# EAGLE schematic IGVC controller v1.6 (EAGLE 6.3)
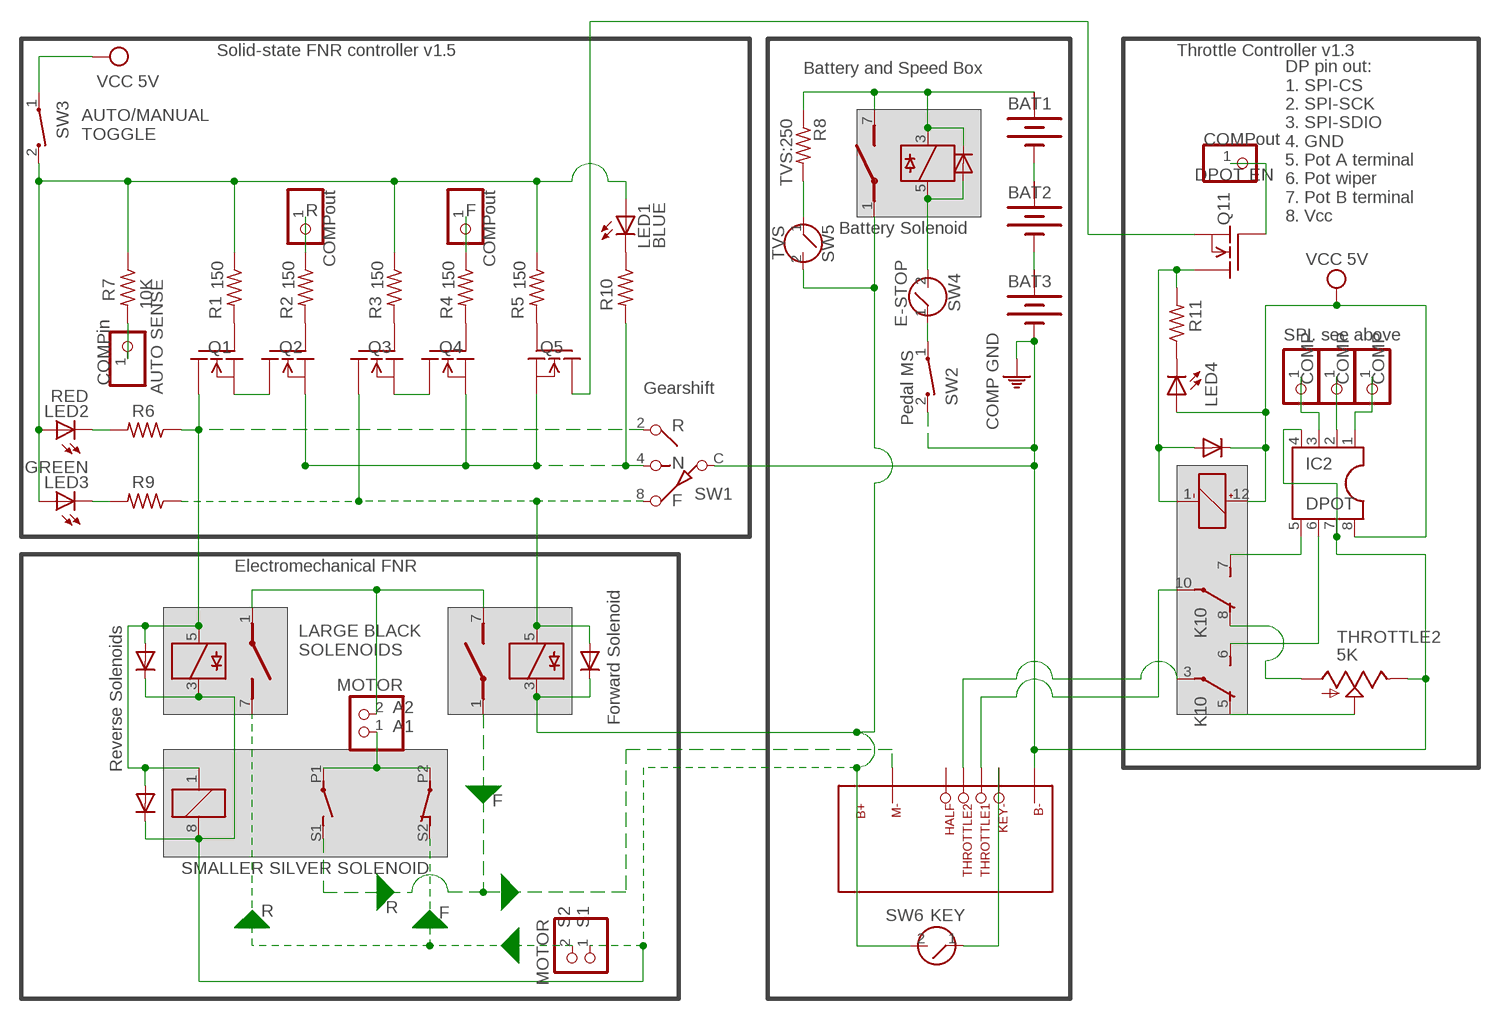
[diagram p0: schematic, sheet 1]

## Parts
BAT1  BATTERY  [BATTERY]
BAT2  BATTERY  [BATTERY]
BAT3  BATTERY  [BATTERY]
D5  1N4004  [DO41-10]
D12  1N4004  [DO41-10]
D13  1N4004  [DO41-10]
D14  1N4004  [DO41-10]
D16  1N4004  [DO41-10]
IC2  DPOT  DIL8  [DIL08]
JP10  COMP  PINHD-1X1  [1X01]
JP11  COMP  PINHD-1X1  [1X01]
JP12  COMP  PINHD-1X1  [1X01]
JP13  COMPout  PINHD-1X1  [1X01]
JP29  MOTOR  PINHD-1X2  [1X02]
JP30  MOTOR  PINHD-1X2  [1X02]
JP31  COMPin  PINHD-1X1  [1X01]
JP32  COMPout  PINHD-1X1  [1X01]
JP33  COMPout  PINHD-1X1  [1X01]
K2  35701331  [REED]
K3  35701331  [REED]
K4  G6C-2117P  [G6C-2117P]
K5  35701331  [REED]
K10  DF2-L-DC24V  [DF2]
LED1  BLUE  LED3MM  [LED3MM]
LED2  RED  LED3MM  [LED3MM]
LED3  GREEN  LED3MM  [LED3MM]
LED4  LED3MM  [LED3MM]
Q1  BUZ11  [TO220]
Q2  BUZ11  [TO220]
Q3  BUZ11  [TO220]
Q4  BUZ11  [TO220]
Q5  BUZ11  [TO220]
Q11  BUZ11  [TO220]
R1  150  R-US_0204/5  [0204/5@1]
R2  150  R-US_0204/5  [0204/5@1]
R3  150  R-US_0204/5  [0204/5@1]
R4  150  R-US_0204/5  [0204/5@1]
R5  150  R-US_0204/5  [0204/5@1]
R6  R-US_0204/5  [0204/5@1]
R7  10K  R-US_0204/5  [0204/5@1]
R8  TVS:250  R-US_0204/5  [0204/5@1]
R9  R-US_0204/5  [0204/5@1]
R10  R-US_0204/5  [0204/5@1]
R11  R-US_0204/5  [0204/5@1]
SW1  SW-1P3T  [SW-C10]
SW2  Pedal MS  CT10-XXXX-A2  [CT10-XXXX-A2]
SW3  Pedal MS  CT10-XXXX-A2  [CT10-XXXX-A2]
SW4  E-STOP  SWITCH  [SWITCH]
SW5  TVS  SWITCH  [SWITCH]
SW6  KEY  SWITCH  [SWITCH]
THROTTLE2  5K  TRIM_US-CT6  [CT6]
U$5  MOTOR-CONTROLLER  [MOTOR-CONTROLLER]

## Nets
+5V [usbvcc]: D5.C IC2.8 K10.12(1:+) LED4.A SW3.1 ; supply symbol labelled VCC 5V
+36V: BAT1.+ D16.C K5.3 K5.7(2:S) R8.1
A1: JP29.1 K4.P1(2:P) K4.P2(3:P)
A2: JP29.2 K2.1(2:P) K3.7(2:S)
B+: D12.C D13.C D14.C JP30.1 K2.3 K3.3 K4.8 K5.1(2:P) SW5.2 SW6.2 U$5.P$2(B+)
FGND1: D14.A K3.5 Q3.2(D) R9.1 SW1.8
GND [gnd]: BAT3.- IC2.4 IC2.7 SW1.C SW2.2 THROTTLE2.E U$5.P$1(B-) ; supply symbol labelled COMP GND
M-1: K3.1(2:P) K4.S1(2:S) U$5.P$3(M-)
N: Q2.3(S) Q4.3(S) Q5.3(S) R10.2 SW1.4
N$1: D16.A K5.5 SW4.2
N$2: LED4.K(C) R11.1
N$3: SW2.1 SW4.1
N$4: Q5.2(D) Q11.3(S)
N$5: Q1.3(S) Q2.2(D)
N$6: Q3.3(S) Q4.2(D)
N$7: Q3.1(G) R3.2
N$8: Q4.1(G) R4.2
N$9: JP32.1 R4.1
N$10: JP33.1 R2.1
N$11: Q5.1(G) R5.2
N$12: LED1.A LED2.A LED3.A R1.1 R3.1 R5.1 R7.1 SW3.2
N$13: LED2.K(C) R6.2
N$14: LED3.K(C) R9.2
N$15: LED1.K(C) R10.1
N$16: K10.3(2:P) U$5.P$6(THROTTLE2)
N$23: K10.10(3:P) U$5.P$5(THROTTLE1)
N$34: R8.2 SW5.1
N$50: K10.5(2:O) THROTTLE2.S
N$51: IC2.5 K10.7(3:S)
N$52: IC2.6 K10.6(2:S)
N$53: K10.8(3:O) THROTTLE2.A
N$54: IC2.2 JP11.1
N$55: IC2.1 JP12.1
N$56: IC2.3 JP10.1
N$57: D5.A K10.1(1:-) Q11.2(D) R11.2
N$58: JP13.1 Q11.1(G)
N$102: BAT1.- BAT2.+
N$104: BAT2.- BAT3.+
N$105: SW6.1 U$5.P$4(KEY-)
N$108: Q1.1(G) R1.2
N$109: Q2.1(G) R2.2
N$110: JP31.1 R7.2
RGND: D12.A D13.A K2.5 K4.1 Q1.2(D) R6.1 SW1.2
S2: JP30.2 K2.7(2:S) K4.S2(3:O)
Unconnected: U$5.P$7(HALF)

## Notes on the sheet
- Solid-state FNR controller v1.5 | Throttle Controller v1.3
- Battery and Speed Box
- AUTO/MANUAL
  TOGGLE
- DPOT EN
- R | F
- DP pin out:
  1. SPI-CS
  2. SPI-SCK
  3. SPI-SDIO
  4. GND
  5. Pot A terminal
  6. Pot wiper
  7. Pot B terminal
  8. Vcc
- Battery Solenoid
- SPI. see above
- AUTO SENSE | Gearshift
- R
  
  N
  
  F
- Electromechanical FNR
- Forward Solenoid
- Reverse Solenoids
- LARGE BLACK
  SOLENOIDS
- A2
  A1
- F
- SMALLER SILVER SOLENOID
- S2
  S1
- R | R
- F

## Power pins joined to a net without a drawn wire
+: BAT1.+@1(+) BAT2.+@1(+) BAT3.+@1(+)

## Library data of the parts
BAT1-BAT3 = special:BATTERY: BATTERY
D5 D12-D14 D16 = adafruit:1N4004: DIODE General purpose 1N400x type rectifier (With bigger pads) http://www.ladyada.net/library/pcb/eaglelibrary.html
IC2 = ic-package:DIL8: Dual In Line / Socket
JP10-JP13 JP31-JP33 = adafruit:PINHD-1X1: Pin header 1x1 for 0.1" spacing With round pins
JP29 JP30 = pinhead:PINHD-1X2: PIN HEADER
K2 K3 K5 = relay:35701331: RELAY reed, 1 x norm. open with polarity; OC_FARNELL: unknown; OC_NEWARK: unknown
K4 = relay:G6C-2117P: RELAY 1 x norm. open, 1x norm. closed, 10 A/240 V, Omron; OC_FARNELL: unknown; OC_NEWARK: unknown
K10 = relay:DF2-?DC*: HIGHLY SENSITIVE DIP MINIATURE RELAY NAiS Single side stable / 1 coil latching Source: http://www.mew-europe.com/.. en_ds_61002_0000.pdf; OC_FARNELL: unknown; OC_NEWARK: unknown
LED1-LED4 = adafruit:LED: LED OSRAM: - CHIPLED LG R971, LG N971, LY N971, LG Q971, LY Q971, LO R971, LY R971 LH N974, LH R974 LS Q976, LO Q976, LY Q976 LO Q996 - Hyper CHIPLED LW Q18S LB Q993, LB Q99A, LB R99A - SideLED LS A670, LO A670, LY A670, LG A670, LP A670 LB A673, LV A673, LT A673, LW A673 LH A674 LY A675 LS A676, LA A676, LO A676, LY A676, LW A676 LS A679, LY A679, LG A679 - Hyper Micro SIDELED® LS Y876, LA Y876, LO Y876, LY Y876 LT Y87S - SmartLED LW L88C, LW L88S LB L89C, LB L89S, LG L890 LS L89K, LO L89K, LY L89K LS L896, LA L896, LO L896, LY L896 - TOPLED LS T670, LO T670, LY T670, LG T670, LP T670 LSG T670, LSP T670, LSY T670, LOP T670, LYG T670 LG T671, LOG T671, LSG T671 LB T673, LV T673, LT T673, LW T673 LH T674 LS T676, LA T676, LO T676, LY T676, LB T676, LH T676, LSB T676, LW T676 LB T67C, LV T67C, LT T67C, LS T67K, LO T67K, LY T67K, LW E67C LS E67B, LA E67B, LO E67B, LY E67B, LB E67C, LV E67C, LT E67C LW T67C LS T679, LY T679, LG T679 LS T770, LO T770, LY T770, LG T770, LP T770 LB T773, LV T773, LT T773, LW T773 LH T774 LS E675, LA E675, LY E675, LS T675 LS T776, LA T776, LO T776, LY T776, LB T776 LHGB T686 LT T68C, LB T68C - Hyper Mini TOPLED® LB M676 - Mini TOPLED Santana® LG M470 LS M47K, LO M47K, LY M47K Source: http://www.osram.convergy.de/
Q1-Q5 Q11 = transistor-fet:BUZ11: N-Channel Enhancement MOSFET 50V; 30A; 0,040Ohm
R1-R11 = rcl:R-US_: RESISTOR, American symbol
SW1 = custom:SW-1P3T: SWITCH 3 position switch 1P3T
SW2 SW3 = switch-coto:CT10-XXXX-: CT10 Series Molded Switch Source: www.cotorelay.com .. Coto_Technology__CT10-1530-G1.pdf
SW4-SW6 = custom:SWITCH: Push button switch
THROTTLE2 = pot:TRIM_US-: POTENTIOMETER
U$5 = custom:MOTOR-CONTROLLER

## Net classes
1 power: width 0.61 mm, drill 0.711 mm, clearance 0.203 mm
2 gnd: width 0.305 mm, drill 0.711 mm, clearance 0.203 mm
3 usbvcc: width 0.508 mm, drill 0.711 mm, clearance 0.203 mm